# Altium schematic sheet PROC010C_CoverSheet.SchDoc
size 431 x 279 mm; Date: Not shown in title block; ApprovedBy: Not shown in title block; CheckedBy: Not shown in title block; Author: Not shown in title block; CompanyName: Not shown in title block; DrawnBy: Adrian Ozer; Engineer: Not shown in title block; Organization: Not shown in title block; Address1: Not shown in title block; Address2: Not shown in title block; Address3: Not shown in title block; Address4: Not shown in title block; DocumentNumber: 1; Revision: Use project parameter SCH_Rev; SheetNumber: 1; SheetTotal: 16; PageSetup: Record=PageOptions|CenterHorizontal=True|CenterVertical=True|PrintScale=1.00|XCorrection=1.00|YCorrection=1.00|PrintKind=0|BorderSize=5000000|LeftOffset=0|BottomOffset=0|Orientation=2|PaperLength=1000|PaperWidth=1000|Scale=100|PaperSource=15|PrintQuality=600|MediaType=1|DitherType=10|PaperKind=Letter|PrintScaleMode=1; CurrentTime: Not shown in title block; CurrentDate: Not shown in title block; Time: Not shown in title block; DocumentFullPathAndName: Not shown in title block; DocumentName: Not shown in title block; ModifiedDate: Not shown in title block; ImagePath: Not shown in title block
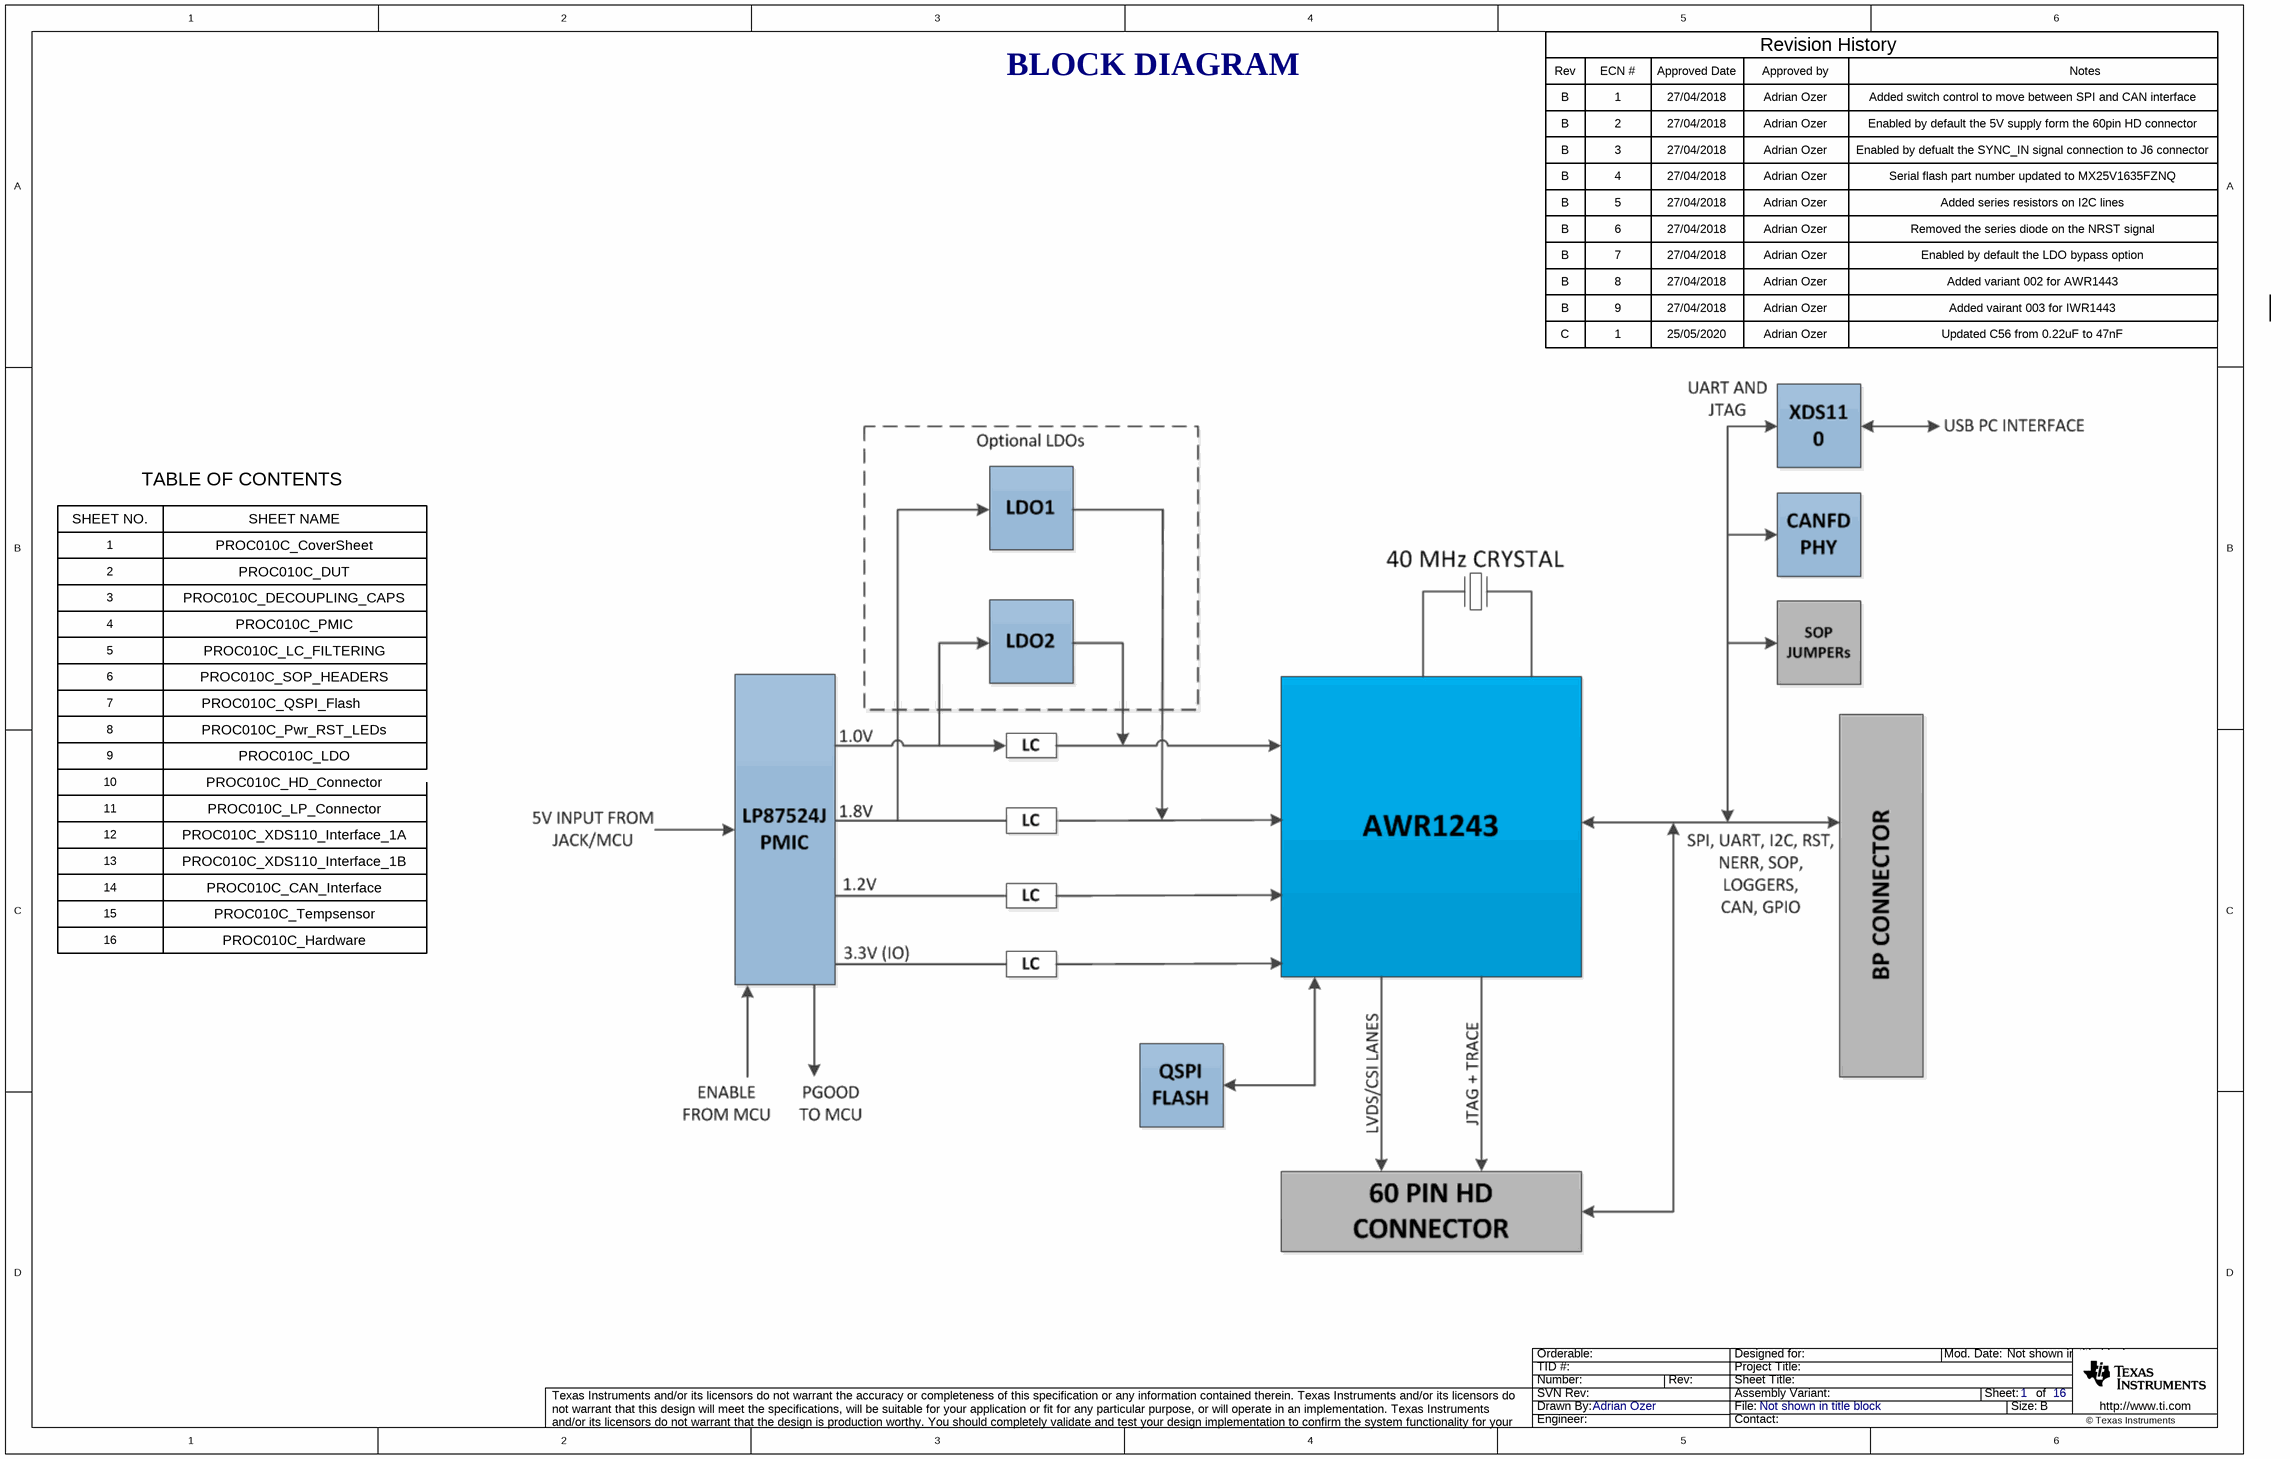
[diagram p0: PROC010C_CoverSheet.SchDoc]

## Notes on the sheet
- BLOCK DIAGRAM
- Rev
- B
- ECN #
- 1
- Approved Date
- 27/04/2018
- Approved by
- Adrian Ozer
- Revision History
- Added switch control to move between SPI and CAN interface
- Notes
- 2
- 3
- Enabled by default the 5V supply form the 60pin HD connector
- Enabled by defualt the SYNC_IN signal connection to J6 connector
- 4
- 5
- 6
- Serial flash part number updated to MX25V1635FZNQ
- Added series resistors on I2C lines
- Removed the series diode on the NRST signal
- 7
- 8
- Enabled by default the LDO bypass option
- Added variant 002 for AWR1443
- C
- 9
- 25/05/2020
- Added vairant 003 for IWR1443
- Updated C56 from 0.22uF to 47nF
- TABLE OF CONTENTS
- SHEET NO.
- SHEET NAME
- PROC010C_CoverSheet
- PROC010C_DUT
- PROC010C_DECOUPLING_CAPS
- PROC010C_PMIC
- PROC010C_LC_FILTERING
- PROC010C_SOP_HEADERS
- PROC010C_QSPI_Flash
- PROC010C_Pwr_RST_LEDs
- PROC010C_LDO
- 11
- 10
- PROC010C_HD_Connector
- PROC010C_LP_Connector
- 12
- 13
- 14
- PROC010C_XDS110_Interface_1A
- PROC010C_XDS110_Interface_1B
- PROC010C_CAN_Interface
- 15
- 16
- PROC010C_Tempsensor
- PROC010C_Hardware
- Drawn By:
- SVN Rev:
- Number:
- TID #:
- Orderable:
- Rev:
- Sheet Title:
- File:
- Project Title:
- Designed for:
- Assembly Variant:
- Mod. Date:
- Sheet:
- Size:
- of
- http://www.ti.com
- Texas Instruments and/or its licensors do not warrant the accuracy or completeness of this specification or any information contained therein. Texas Instruments and/or its licensors do not warrant that this design will meet the specifications, will be suitable for your application or fit for any particular purpose, or will operate in an implementation. Texas Instruments and/or its licensors do not warrant that the design is production worthy. You should completely validate and test your design implementation to confirm the system functionality for your application.
- Engineer:
- Contact:
- © Texas Instruments